# Altium schematic sheet USB-ETH CHIP.SchDoc: USB-ETH
size A2; Author: Luca Schenetti; DrawnBy: Luca Schenetti; Revision: C; SheetNumber: 2; SheetTotal: 4
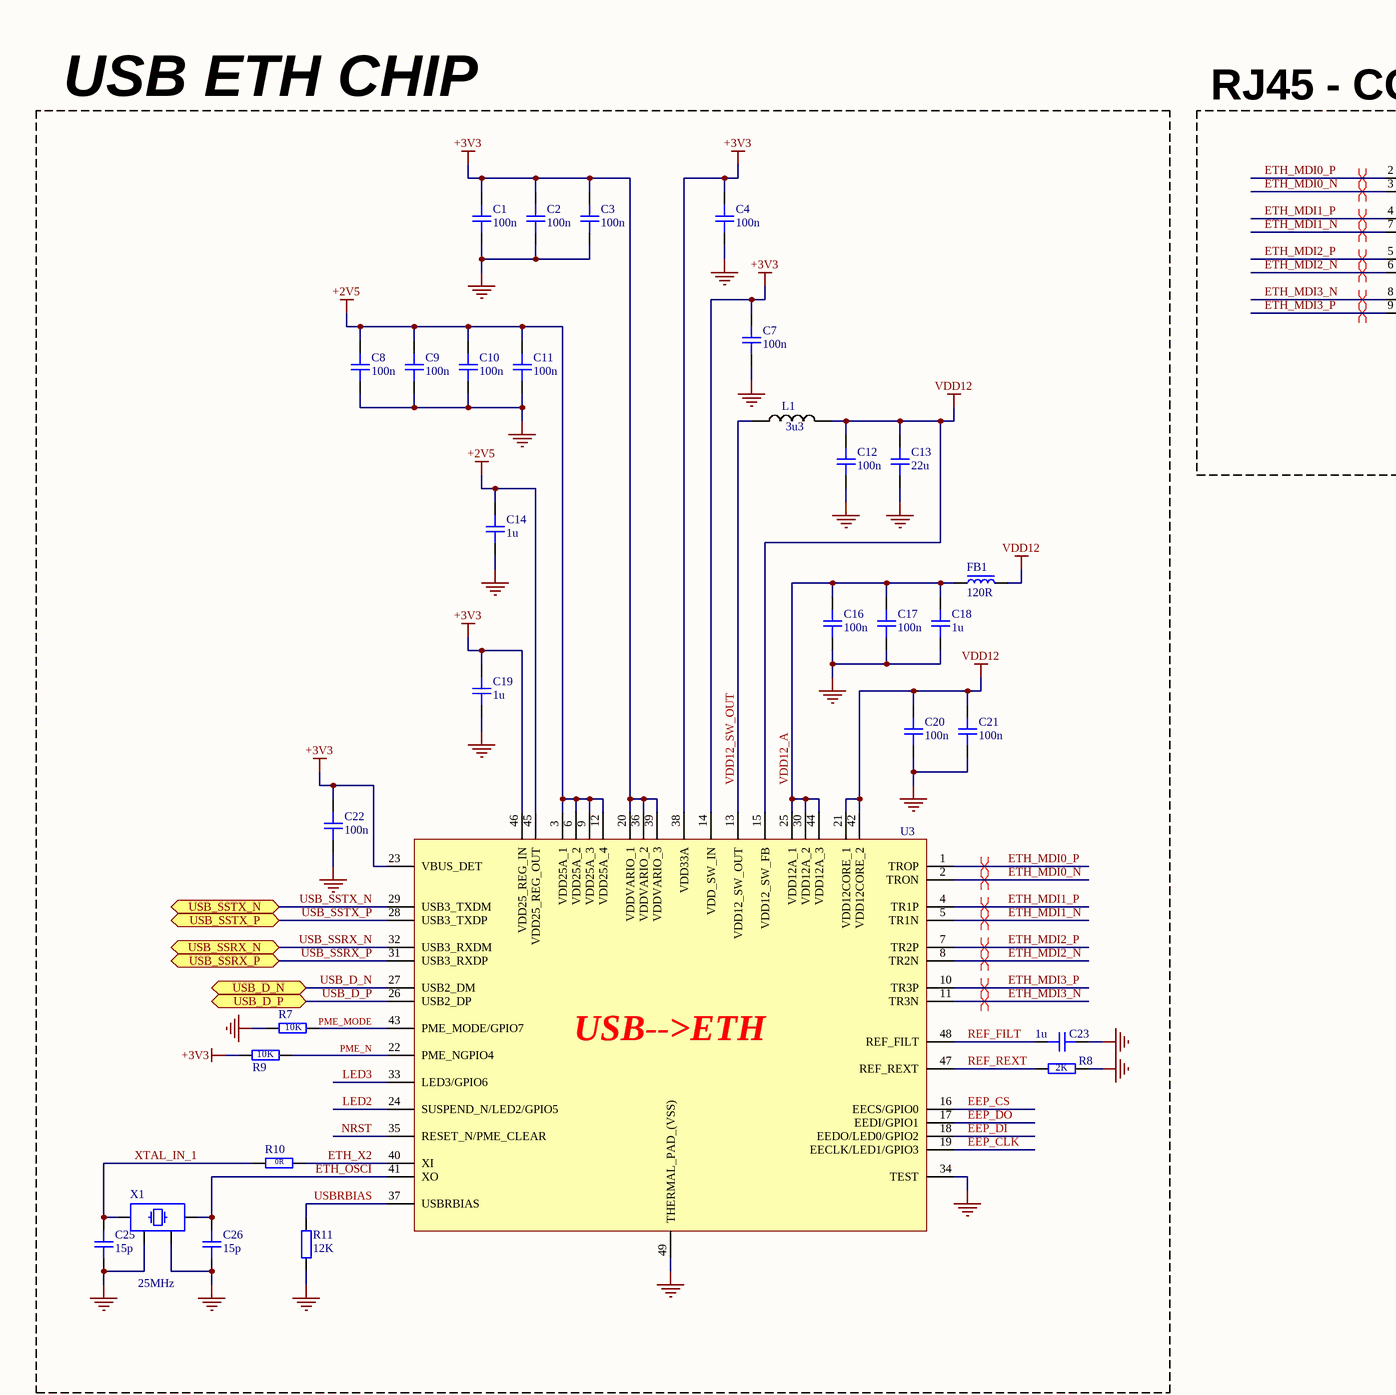
[diagram p0: USB-ETH CHIP.SchDoc, left]
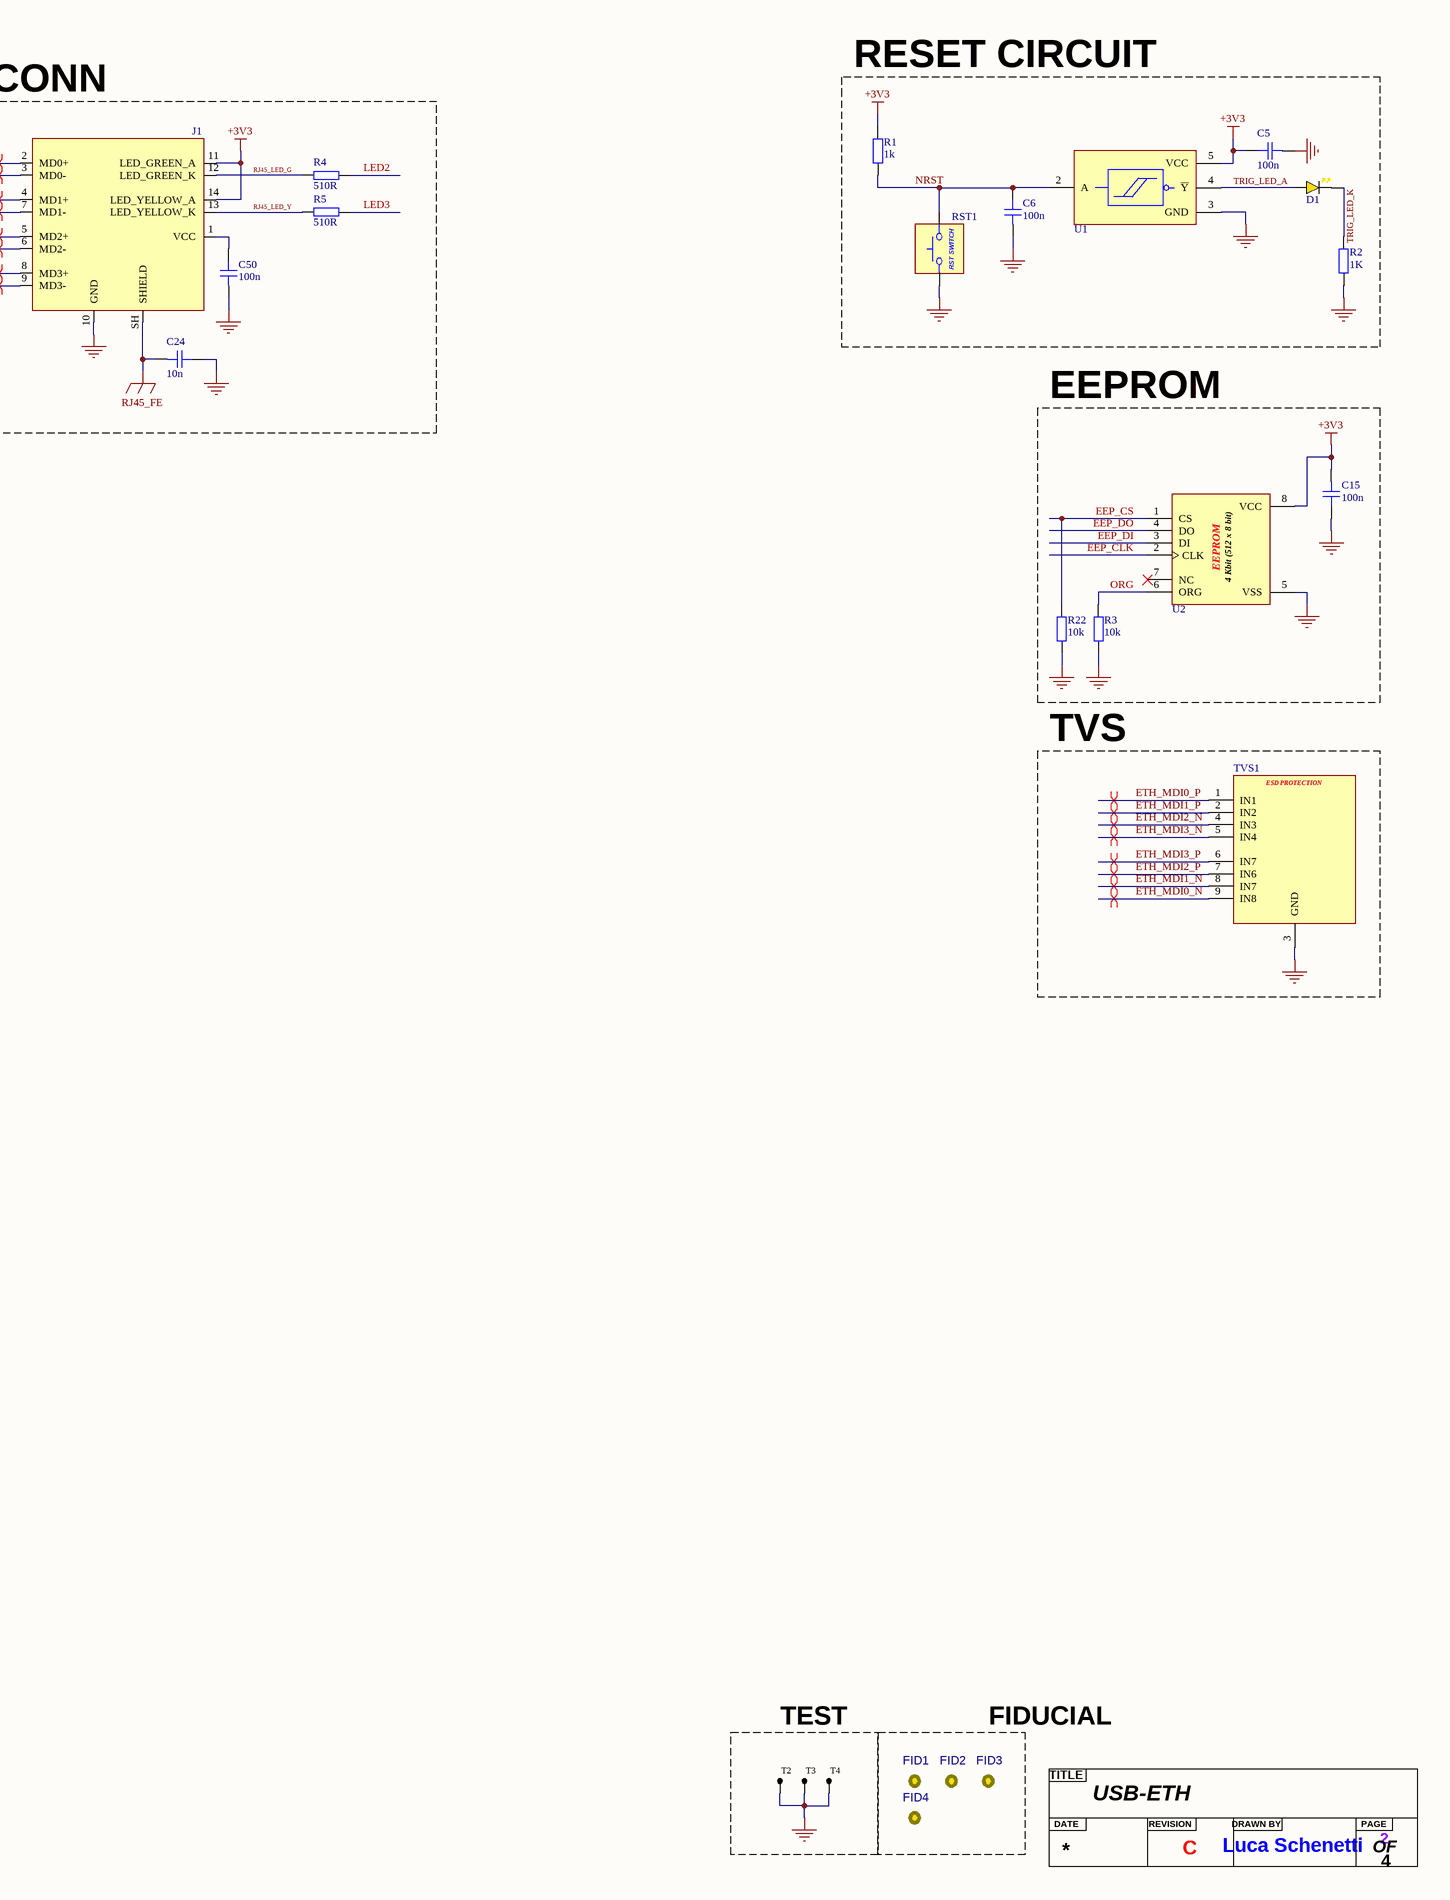
[diagram p1: USB-ETH CHIP.SchDoc, right]

## Parts
?  Title  (value not drawn)  (graphical)
C1  100n  [CAP_0402]
C2  100n  [CAP_0402]
C3  100n  [CAP_0402]
C4  100n  [CAP_0402]
C5  100n  [CAP_0402]
C6  100n  [CAP_0402]
C7  100n  [CAP_0402]
C8  100n  [CAP_0402]
C9  100n  [CAP_0402]
C10  100n  [CAP_0402]
C11  100n  [CAP_0402]
C12  100n  [CAP_0402]
C13  22u  [CAP_0402]
C14  1u  [CAP_0402]
C15  100n  [CAP_0402]
C16  100n  [CAP_0402]
C17  100n  [CAP_0402]
C18  1u  [CAP_0402]
C19  1u  [CAP_0402]
C20  100n  [CAP_0402]
C21  100n  [CAP_0402]
C22  100n  [CAP_0402]
C23  1u  [CAP_0402]
C24  10n  [CAP_1206]
C25  15p  [CAP_0402]
C26  15p  [CAP_0402]
C50  100n  [CAP_0402]
D1  YELLOW  [LED_0603_YELLOW]  (value not drawn)
FB1  120R  [FB_0402]
FID1  FIDUCIAL  [FIDUCIAL]  (value not drawn)  (no BOM)
FID2  FIDUCIAL  [FIDUCIAL]  (value not drawn)  (no BOM)
FID3  FIDUCIAL  [FIDUCIAL]  (value not drawn)  (no BOM)
FID4  FIDUCIAL  [FIDUCIAL]  (value not drawn)  (no BOM)
J1  100/1000Base-T RJ45 MAGJACK  [HR911130A]  (value not drawn)
L1  3u3  [INDUCTOR 1210]
R1  1k  [RES_0402]
R2  1K  [RES_0402]
R3  10k  [RES_0402]
R4  510R  [RES_0402]
R5  510R  [RES_0402]
R7  10K  [RES_0402]
R8  2K  [RES_0402]
R9  10K  [RES_0402]
R10  0R  [RES_0402]
R11  12K  [RES_0402]
R22  10k  [RES_0402]
RST1  RST_SWITCH_STM32  [RST_SWITCH]  (value not drawn)
T2  TP_S  [TP 1mm]  (value not drawn)  (no BOM)
T3  TP_S  [TP 1mm]  (value not drawn)  (no BOM)
T4  TP_S  [TP 1mm]  (value not drawn)  (no BOM)
TVS1  8-Line Ultra Low Capacitance TVS Diode Array  [RCLAMP3328P]  (value not drawn)
U1  Schmitt Trigger 1.65V~5.5V  [74LVC1G14GW,125]  (value not drawn)
U2  EEPROM 1.8V~5.5V 4Kbit SPI  [93AA66C-I/SN]  (value not drawn)
U3  ETH-USB 3.1  [LAN7800T/VSX]  (value not drawn)
X1  25MHz  [XTAL_3225]

## Blocks framed on the sheet
USB ETH CHIP: C1-C4 C7-C14 C16-C23 C25 C26 FB1 L1 R7-R11 U3 X1
RJ45 - CONN: C24 C50 J1 R4 R5
RESET CIRCUIT: C5 C6 D1 R1 R2 RST1 U1
EEPROM: C15 R3 R22 U2
TVS: TVS1
TEST: T2-T4
FIDUCIAL: FID1-FID4

## Ports
USB_D_N (bidir, see USB CONN[6B]), USB_D_P (bidir, see USB CONN[6B]), USB_SSRX_N (bidir, see USB CONN[6A]), USB_SSRX_P (bidir, see USB CONN[6A]), USB_SSTX_N (bidir, see USB CONN[6A]), USB_SSTX_P (bidir, see USB CONN[6A])

## Nets
+2V5: C8.2 C9.2 C10.2 C11.2 C14.2 U3.3(VDD25A_1) U3.6(VDD25A_2) U3.9(VDD25A_3) U3.12(VDD25A_4) U3.45(VDD25_REG_OUT)
+3V3: C1.2 C2.2 C3.2 C4.2 C5.2 C7.2 C15.1 C19.2 C22.1 J1.11(LED_GREEN_A) J1.14(LED_YELLOW_A) R1.2 R9.1 U1.5(VCC) U2.8(VCC) U3.14(VDD_SW_IN) U3.20(VDDVARIO_1) U3.23(VBUS_DET) U3.36(VDDVARIO_2) U3.38(VDD33A) U3.39(VDDVARIO_3) U3.46(VDD25_REG_IN)
GND: C1.1 C2.1 C3.1 C4.1 C5.1 C6.1 C7.1 C8.1 C9.1 C10.1 C11.1 C12.1 C13.1 C14.1 C15.2 C16.1 C17.1 C18.1 C19.1 C20.1 C21.1 C22.2 C23.1 C24.2 C25.1 C26.1 C50.1 J1.10(GND) R2.1 R3.1 R7.1 R8.2 R11.1 R22.1 RST1.1 T2.1 T3.1 T4.1 TVS1.3(GND) U1.3(GND) U2.5(VSS) U3.34(TEST) U3.49(THERMAL_PAD_(VSS)) X1.2 X1.4
RJ45_FE: C24.1 J1.SH(SHIELD)
VDD12: C12.2 C13.2 C20.2 C21.2 FB1.2 L1.2 U3.15(VDD12_SW_FB) U3.21(VDD12CORE_1) U3.42(VDD12CORE_2)
EEP_CLK: U2.2(CLK) U3.19(EECLK/LED1/GPIO3)
EEP_CS: R22.2 U2.1(CS) U3.16(EECS/GPIO0)
EEP_DI: U2.3(DI) U3.18(EEDO/LED0/GPIO2)
EEP_DO: U2.4(DO) U3.17(EEDI/GPIO1)
ETH_MDI0_N: J1.3(MD0-) TVS1.9(IN8) U3.2(TRON)
ETH_MDI0_P: J1.2(MD0+) TVS1.1(IN1) U3.1(TROP)
ETH_MDI1_N: J1.7(MD1-) TVS1.8(IN7) U3.5(TR1N)
ETH_MDI1_P: J1.4(MD1+) TVS1.2(IN2) U3.4(TR1P)
ETH_MDI2_N: J1.6(MD2-) TVS1.4(IN3) U3.8(TR2N)
ETH_MDI2_P: J1.5(MD2+) TVS1.7(IN6) U3.7(TR2P)
ETH_MDI3_N: J1.8(MD3+) TVS1.5(IN4) U3.11(TR3N)
ETH_MDI3_P: J1.9(MD3-) TVS1.6(IN7) U3.10(TR3P)
ETH_OSCI: C26.2 U3.41(XO) X1.1
ETH_X2: R10.2 U3.40(XI)
LED2: R4.2 U3.24(SUSPEND_N/LED2/GPIO5)
LED3: R5.2 U3.33(LED3/GPIO6)
NRST: C6.2 R1.1 RST1.2 U1.2(A) U3.35(RESET_N/PME_CLEAR)
ORG: R3.2 U2.6(ORG)
PME_MODE: R7.2 U3.43(PME_MODE/GPIO7)
PME_N: R9.2 U3.22(PME_NGPIO4)
REF_FILT: C23.2 U3.48(REF_FILT)
REF_REXT: R8.1 U3.47(REF_REXT)
RJ45_LED_G: J1.12(LED_GREEN_K) R4.1
RJ45_LED_Y: J1.13(LED_YELLOW_K) R5.1
TRIG_LED_A: D1.A U1.4(~{Y})
TRIG_LED_K: D1.K R2.2
USB_D_N: U3.27(USB2_DM) ; port USB_D_N
USB_D_P: U3.26(USB2_DP) ; port USB_D_P
USB_SSRX_N: U3.32(USB3_RXDM) ; port USB_SSRX_N
USB_SSRX_P: U3.31(USB3_RXDP) ; port USB_SSRX_P
USB_SSTX_N: U3.29(USB3_TXDM) ; port USB_SSTX_N
USB_SSTX_P: U3.28(USB3_TXDP) ; port USB_SSTX_P
USBRBIAS: R11.2 U3.37(USBRBIAS)
VDD12_A: C16.2 C17.2 C18.2 FB1.1 U3.25(VDD12A_1) U3.30(VDD12A_2) U3.44(VDD12A_3)
VDD12_SW_OUT: L1.1 U3.13(VDD12_SW_OUT)
XTAL_IN_1: C25.2 R10.1 X1.3
NetC50_2: C50.2 J1.1(VCC)

Not connected (* = marked no-connect by the designer): U2 7(NC)*

## Layout directives
differential pair; differential pair class DIFF_MDI_100Ω; rule Matched Net Lengths [Delay Tolerance = 50ps]: ETH_MDI0_N, ETH_MDI0_P, ETH_MDI1_N, ETH_MDI1_P, ETH_MDI2_N, ETH_MDI2_P, ETH_MDI3_N, ETH_MDI3_P

## Notes on the sheet
- (in symbol 93AA66C-I/SN) EEPROM; 4 Kbit (512 x 8 bit)
- (in symbol LAN7800T/VSX) USB-->ETH
- (in symbol RCLAMP3328P) ESD PROTECTION
- (in symbol RST_SWITCH) RST SWITCH
- (in symbol Title) TITLE; DATE; REVISION; DRAWN BY; PAGE; OF

## Library data of the parts
C1-C12 C15-C17 C20-C22 C50 = CAP_0402: [C307331]; Manufacturer: *; Manufacturer Part Number: *; Distributor Link: *; LCSC: *; Rating: *; Dielectric: *
C13 = CAP_0402: [C415703]; Manufacturer: *; Manufacturer Part Number: *; Distributor Link: *; LCSC: *; Rating: *; Dielectric: *
C14 C18 C19 C23 = CAP_0402: [C52923]; Manufacturer: *; Manufacturer Part Number: *; Distributor Link: *; LCSC: *; Rating: *; Dielectric: *
C24 = CAP_1206: [C1846]; Manufacturer: *; Manufacturer Part Number: *; Distributor Link: *; LCSC: *; Rating: *; Dielectric: *
C25 C26 = CAP_0402: Capacitor SMD 0402 [C1548]; Manufacturer: *; Manufacturer Part Number: *; Distributor Link: *; LCSC: *; Rating: *; Dielectric: *
D1 = LED_0603_YELLOW: [C89811]
FB1 = FB_0402: [C76891]; Manufacturer: *; Manufacturer Part Number: *; Distributor Link: *; LCSC: *
J1 = HR911130A: [C54408]; Manufacturer: Hanrun; Manufacturer Part Number: HR911130A
L1 = INDUCTOR 1210: [C2047622]
R1 = RES_0402: [C11702]; Manufacturer: *; Manufacturer Part Number: *; Distributor Link: *; LCSC: *
R2 = RES_0402: Resistor SMD 0402 [C11702]; Manufacturer: *; Manufacturer Part Number: *; Distributor Link: *; LCSC: *
R3 R7 R9 R22 = RES_0402: [C25744]; Manufacturer: *; Manufacturer Part Number: *; Distributor Link: *; LCSC: *
R4 R5 = RES_0402: [C25123]; Manufacturer: *; Manufacturer Part Number: *; Distributor Link: *; LCSC: *
R8 = RES_0402: [C4109]; Manufacturer: *; Manufacturer Part Number: *; Distributor Link: *; LCSC: *
R10 = RES_0402: Resistor SMD 0402 [C17168]; Manufacturer: *; Manufacturer Part Number: *; Distributor Link: *; LCSC: *
R11 = RES_0402: [C25752]; Manufacturer: *; Manufacturer Part Number: *; Distributor Link: *; LCSC: *
RST1 = RST_SWITCH: [C720477]
T2-T4 = TP_S: test point
TVS1 = RCLAMP3328P: [C28646386]
U1 = 74LVC1G14GW,125: [C265125]
U2 = 93AA66C-I/SN: [C153277]
U3 = LAN7800T/VSX: [C625082]
X1 = TSX-3225_24.0000MF15X-AC: C9006; Manufacturer: Epson; Manufacturer Part Number: TSX-3225 24.0000MF15X-AC
FID1-FID4 = FIDUCIAL: Revision: 0; Description_: FIDUCIAL; DNP: DNP